# EAGLE schematic Schematic_v4 (EAGLE 9.6.2)
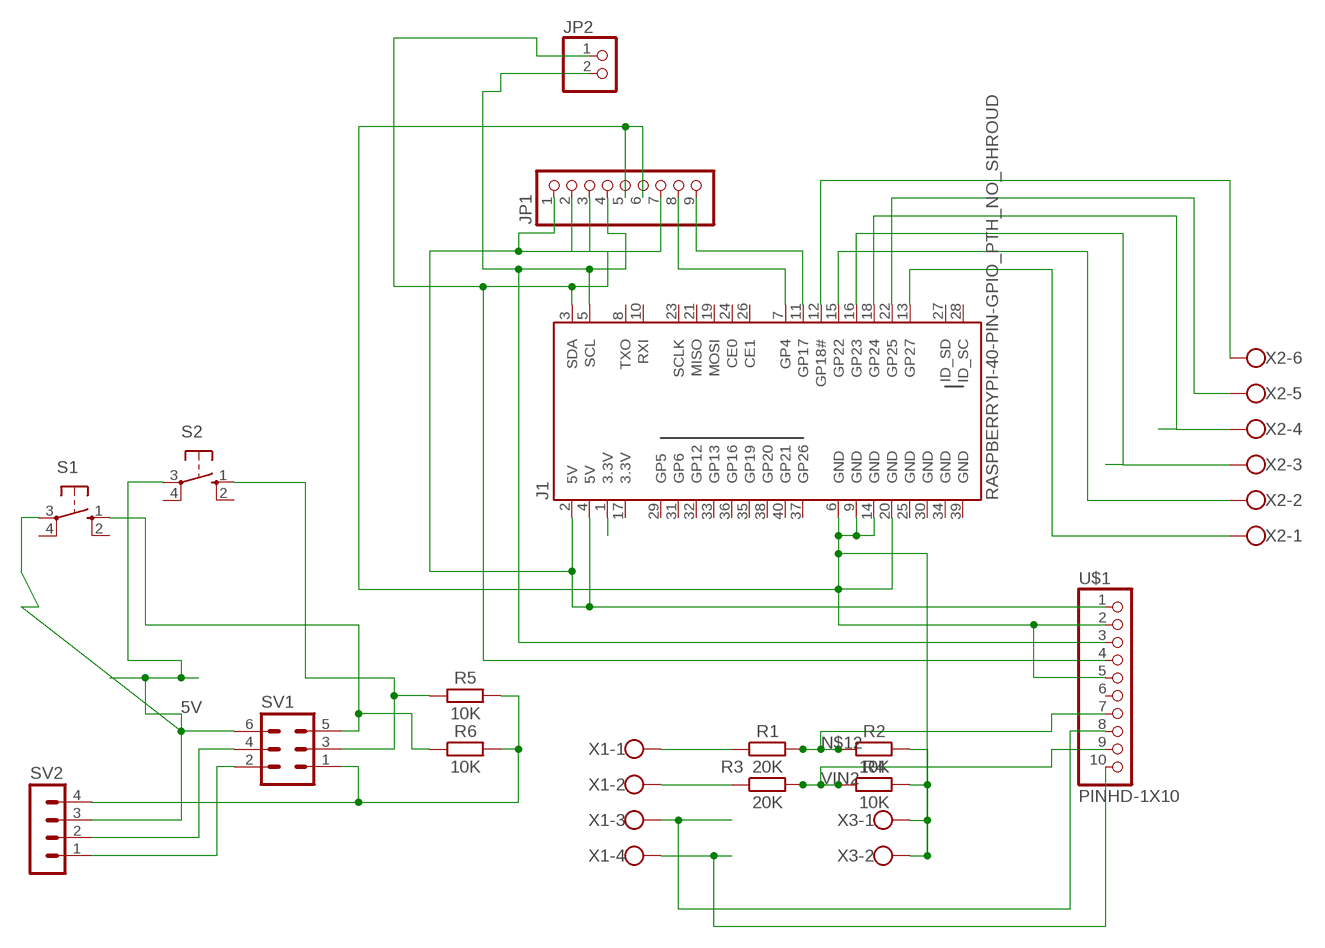
[diagram p0: schematic, sheet 1]

## Parts
J1  RASPBERRYPI-40-PIN-GPIO_PTH_NO_SHROUD  [2X20]
JP1  PINHD-1X9  [1X09-BIG]
JP2  PINHD-1X2  [1X02]
R1  20K  R_CHIP-1206(3216-METRIC)  [RESC3216X70]
R2  10K  R_CHIP-1206(3216-METRIC)  [RESC3216X70]
R3  20K  R_CHIP-1206(3216-METRIC)  [RESC3216X70]
R4  10K  R_CHIP-1206(3216-METRIC)  [RESC3216X70]
R5  10K  R_CHIP-1206(3216-METRIC)  [RESC3216X70]
R6  10K  R_CHIP-1206(3216-METRIC)  [RESC3216X70]
S1  40-XX  [B3F-40XX]
S2  40-XX  [B3F-40XX]
SV1  MA03-2  [MA03-2]
SV2  MA04-1  [MA04-1]
U$1  PINHD-1X10  [1X10-BIG]
X1  W237-4  [W237-4]
X2  W237-136  [W237-136]
X3  W237-102  [W237-102]

## Nets
5V: S1.3(P) S2.3(P) SV1.6 SV2.3
GND: J1.6(GND) J1.9(GND) J1.14(GND) J1.20(GND) JP1.5 JP1.6 R2.2 R4.2 U$1.2 U$1.5 X3.1 X3.2
N$1: J1.13(GP27) X2.1
N$2: J1.15(GP22) X2.2
N$3: R1.1 X1.1
N$4: J1.2(5V) J1.4(5V) JP1.1 JP1.2 JP1.7 U$1.1
N$5: SV1.4 SV2.2
N$6: R3.1 X1.2
N$7: R5.2 R6.2 SV1.1 SV2.4
N$8: J1.5(SCL) JP1.4 JP2.2 U$1.3
N$9: U$1.8 X1.3
N$10: U$1.10 X1.4
N$11: J1.16(GP23) X2.3
N$12: R1.2 R2.1 U$1.7
N$13: J1.18(GP24) X2.4
N$14: J1.22(GP25) X2.5
N$15: J1.12(GP18#) X2.6
N$16: J1.11(GP17) JP1.9
N$17: J1.7(GP4) JP1.8
N$18: SV1.2 SV2.1
N$19: R6.1 S1.1(S) SV1.5
N$21: R5.1 S2.1(S) SV1.3
N$23: J1.3(SDA) JP1.3 JP2.1 U$1.4
N$27: J1.1(3.3V)
VIN2: R3.2 R4.1 U$1.9
Unconnected: J1.8(TXO) J1.10(RXI) J1.19(MOSI) J1.21(MISO) J1.23(SCLK) J1.24(CE0) J1.26(CE1) J1.27(ID_SD) J1.28(ID_SC) J1.29(GP5) J1.31(GP6) J1.32(GP12) J1.33(GP13) J1.35(GP19) J1.36(GP16) J1.37(GP26) J1.38(GP20) J1.40(GP21) S1.2(S1) S1.4(P1) S2.2(S1) S2.4(P1) U$1.6

## Power pins joined to a net without a drawn wire
3.3V: J1.17(3.3V)
GND: J1.25(GND) J1.30(GND) J1.34(GND) J1.39(GND)

## Library data of the parts
J1 = SparkFun-Connectors:RASPBERRYPI-40-PIN-GPIO: Raspberry Pi GPIO Header 2x20 pin connector, as found on B, B+, A+ models. Both shrouded PTH and SMT versions available. SparkFun Products: GPIO Shrouded Header <https://www.sparkfun.com/products/13054>- PTH SparkFun Pi Wedge (Preassembled) <https://www.sparkfun.com/products/13717>
JP1 = adafruit:PINHD-1X9: Pin header 1x10 0.1" spacing With round pins
JP2 = pinhead:PINHD-1X2: PIN HEADER
R1-R6 = Resistor:R: Resistor Fixed - Generic; CATEGORY: Resistor; SUB-CATEGORY: Fixed
S1 S2 = switch-omron:40-XX: OMRON SWITCH; MF: OMRON COMPONENTS USA; MPN: B3F-4000; OC_FARNELL: 176434; OC_NEWARK: 36K3105
SV1 = con-lstb:MA03-2: PIN HEADER; OC_FARNELL: unknown; OC_NEWARK: unknown
SV2 = con-lstb:MA04-1: PIN HEADER; OC_FARNELL: unknown; OC_NEWARK: unknown
U$1 = adafruit:PINHD-1X10: Pin header 1x10 0.1" spacing With round pins
X1 = con-wago-500:W237-4: WAGO SCREW CLAMP; OC_FARNELL: unknown; OC_NEWARK: unknown
X2 = con-wago-500:W237-136: WAGO SCREW CLAMP; MPN: 237-136; OC_FARNELL: unknown; OC_NEWARK: 84K9151
X3 = con-wago-500:W237-102: WAGO SCREW CLAMP; MPN: 237-102; OC_FARNELL: unknown; OC_NEWARK: 70K9898

## Net classes
0 default: clearance 0.205 mm